# Altium schematic sheet PSU_VCC_CRUVI_ADJ_Buck.SchDoc
size A3; SheetNumber: 12; SheetTotal: 32
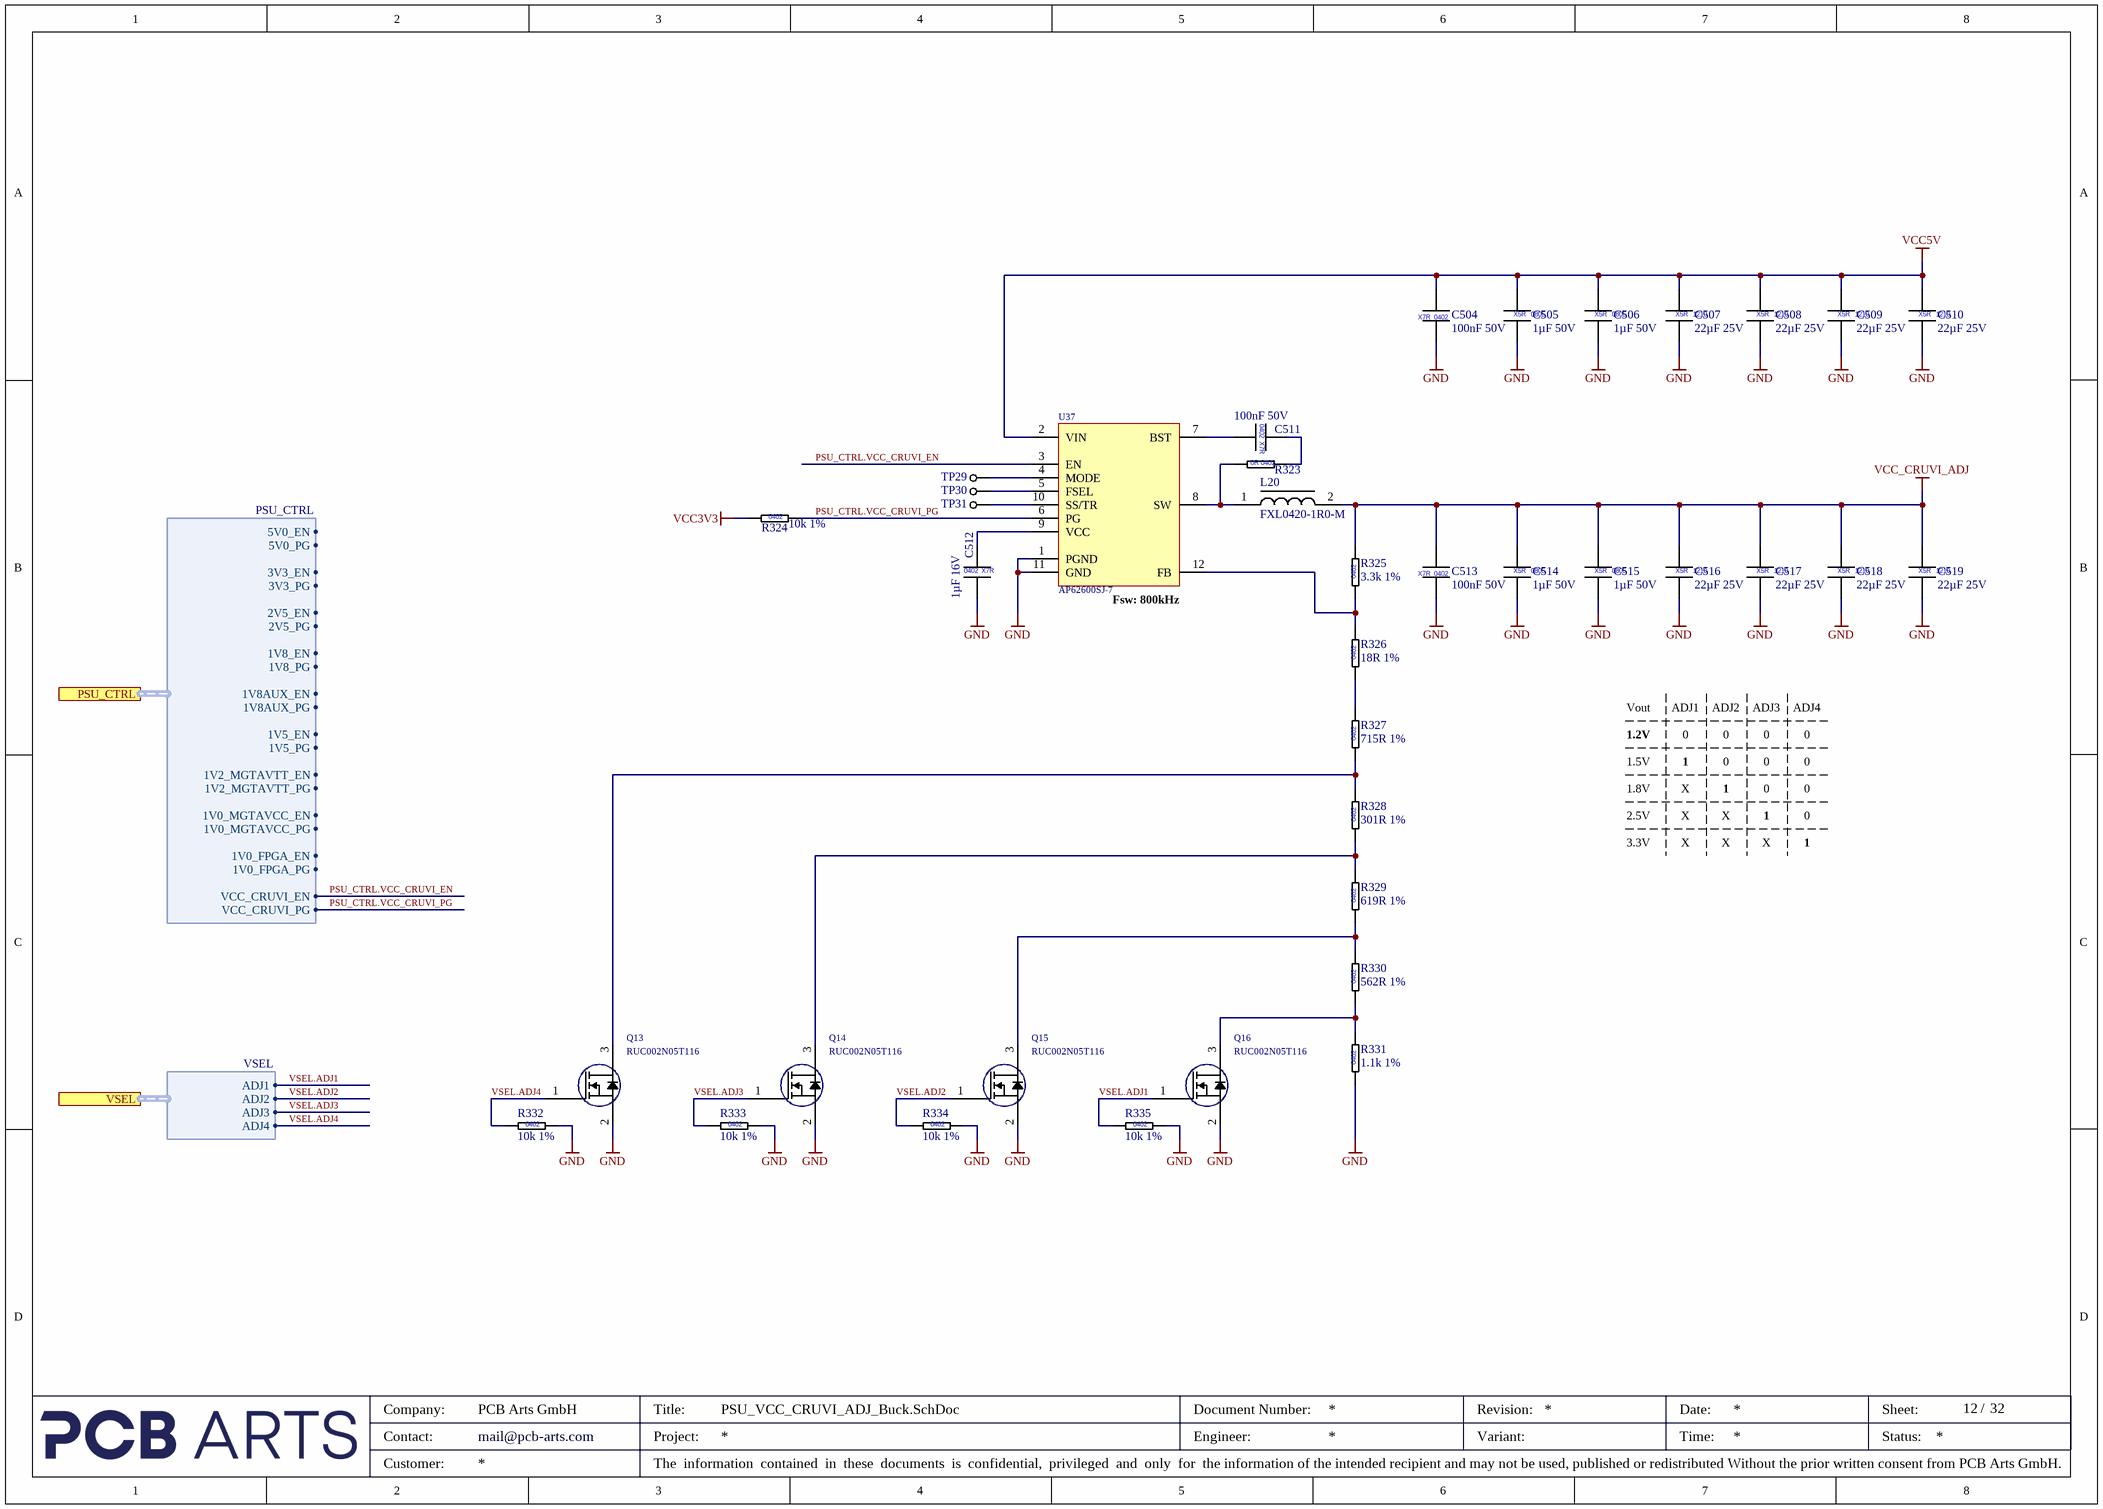
[diagram p0: PSU_VCC_CRUVI_ADJ_Buck.SchDoc]

## Parts
C504  100nF 50V  [CAP_0402_L]
C505  1µF 50V  [CAP_0805]
C506  1µF 50V  [CAP_0805]
C507  22µF 25V  [CAP_1210]
C508  22µF 25V  [CAP_1210]
C509  22µF 25V  [CAP_1210]
C510  22µF 25V  [CAP_1210]
C511  100nF 50V  [CAP_0402_L]
C512  1µF 16V  [CAP_0402_L]
C513  100nF 50V  [CAP_0402_L]
C514  1µF 50V  [CAP_0805]
C515  1µF 50V  [CAP_0805]
C516  22µF 25V  [CAP_1210]
C517  22µF 25V  [CAP_1210]
C518  22µF 25V  [CAP_1210]
C519  22µF 25V  [CAP_1210]
L20  FXL0420-1R0-M  [FXL0420-1R0-M]
Q13  RUC002N05T116  [SOT95P251X112-3N]
Q14  RUC002N05T116  [SOT95P251X112-3N]
Q15  RUC002N05T116  [SOT95P251X112-3N]
Q16  RUC002N05T116  [SOT95P251X112-3N]
R323  0R Jumper  [RES_0402_L]  (value not drawn)
R324  10k 1%  [RES_0402_L]
R325  3.3k 1%  [RES_0402_L]
R326  18R 1%  [RES_0402_L]
R327  715R 1%  [RES_0402_L]
R328  301R 1%  [RES_0402_L]
R329  619R 1%  [RES_0402_L]
R330  562R 1%  [RES_0402_L]
R331  1.1k 1%  [RES_0402_L]
R332  10k 1%  [RES_0402_L]
R333  10k 1%  [RES_0402_L]
R334  10k 1%  [RES_0402_L]
R335  10k 1%  [RES_0402_L]
TP29  Testpoint  [Testpoint 0.8mm]  (value not drawn)  (no BOM)
TP30  Testpoint  [Testpoint 0.8mm]  (value not drawn)  (no BOM)
TP31  Testpoint  [Testpoint 0.8mm]  (value not drawn)  (no BOM)
U37  AP62600SJ-7  [QFN50P200x300x85-12]

## Ports
PSU_CTRL (harness PSU_CTRL, see Power-Tree[2D], PSU_MGTAVCC_Buck[1B], PSU_MGTAVTT_Buck[1B], PSU_VCC1V0_FPGA_Buck[1B], PSU_VCC1V5_Buck[1B], PSU_VCC1V8_Buck[1B], PSU_VCC1V8AUX_Buck[1B], PSU_VCC2V5_Buck[1B], PSU_VCC3V3_Buck[1B], PSU_VCC5V_Buck[1B]), VSEL (harness VSEL, see Power-Tree[2D], Bank 13_Bank 15_Bank 16[8D], Power-Tree[1D])

## Harnesses
PSU_CTRL: 5V0_EN, 5V0_PG, 3V3_EN, 3V3_PG, 2V5_EN, 2V5_PG, 1V8_EN, 1V8_PG, 1V8AUX_EN, 1V8AUX_PG, 1V5_EN, 1V5_PG, 1V2_MGTAVTT_EN, 1V2_MGTAVTT_PG, 1V0_MGTAVCC_EN, 1V0_MGTAVCC_PG, 1V0_FPGA_EN, 1V0_FPGA_PG, VCC_CRUVI_EN, VCC_CRUVI_PG
VSEL: ADJ1, ADJ2, ADJ3, ADJ4

## Nets
GND: C504.1 C505.2 C506.2 C507.2 C508.2 C509.2 C510.2 C512.2 C513.1 C514.2 C515.2 C516.2 C517.2 C518.2 C519.2 Q13.2(D) Q14.2(D) Q15.2(D) Q16.2(D) R331.1 R332.2 R333.2 R334.2 R335.2 U37.1(PGND) U37.11(GND)
VCC3V3: R324.1
VCC5V: C504.2 C505.1 C506.1 C507.1 C508.1 C509.1 C510.1 U37.2(VIN)
VCC_CRUVI_ADJ: C513.2 C514.1 C515.1 C516.1 C517.1 C518.1 C519.1 L20.2 R325.2
PSU_CTRL.VCC_CRUVI_EN: U37.3(EN) ; port PSU_CTRL.VCC_CRUVI_EN
PSU_CTRL.VCC_CRUVI_PG: R324.2 U37.6(PG) ; port PSU_CTRL.VCC_CRUVI_PG
VSEL.ADJ1: Q16.1(G) R335.1 ; port VSEL.ADJ1
VSEL.ADJ2: Q15.1(G) R334.1 ; port VSEL.ADJ2
VSEL.ADJ3: Q14.1(G) R333.1 ; port VSEL.ADJ3
VSEL.ADJ4: Q13.1(G) R332.1 ; port VSEL.ADJ4
NetC511_1: C511.1 R323.2
NetC511_2: C511.2 U37.7(BST)
NetC512_1: C512.1 U37.9(VCC)
NetL20_1: L20.1 R323.1 U37.8(SW)
NetQ13_3: Q13.3(S) R327.1 R328.2
NetQ14_3: Q14.3(S) R328.1 R329.2
NetQ15_3: Q15.3(S) R329.1 R330.2
NetQ16_3: Q16.3(S) R330.1 R331.2
NetR325_1: R325.1 R326.2 U37.12(FB)
NetR326_1: R326.1 R327.2
NetTP29_1: TP29.1(GND) U37.4(MODE)
NetTP30_1: TP30.1(GND) U37.5(FSEL)
NetTP31_1: TP31.1(GND) U37.10(SS/TR)

## Notes on the sheet
- (near U37) Fsw: 800kHz
- Vout
- ADJ1
- ADJ2
- ADJ3
- ADJ4
- 1.2V
- 1.5V
- 1.8V
- 1
- X
- 0
- 2.5V
- 3.3V
- Company:
- Contact:
- Customer:
- mail@pcb-arts.com
- PCB Arts GmbH
- Title:
- Project:
- The  information  contained  in  these  documents  is  confidential,  privileged  and  only  for  the information of the intended recipient and may not be used, published or redistributed Without the prior written consent from PCB Arts GmbH.
- Engineer:
- Document Number:
- Revision:
- Variant:
- Date:
- Time:
- Sheet:
- Status:
- /
- (in symbol CAP_0402_1µF_16V) 0402; X7R
- (in symbol CAP_0402_100nF_50V) 0402; X7R
- (in symbol CAP_0805_1µF_50V) X5R; 0805
- (in symbol CAP_1210_22µF_25V) X5R; 1210
- (in symbol RES_0402_0R Jumper) 0R 0402
- (in symbol RES_0402_1.1k_1%) 0402
- (in symbol RES_0402_3.3k_1%) 0402
- (in symbol RES_0402_10k_1%) 0402
- (in symbol RES_0402_18R_1%) 0402
- (in symbol RES_0402_301R_1%) 0402
- (in symbol RES_0402_562R_1%) 0402
- (in symbol RES_0402_619R_1%) 0402
- (in symbol RES_0402_715R_1%) 0402

## Library data of the parts
C504 C511 C513 = CAP_0402_100nF_50V: Multilayer Ceramic Capacitors MLCC - SMD/SMT 0402 50VDC; Manufacturer 1: Murata Electronics; Manufacturer 1 Prt. Nr.: GCM155L8EH104KE07D; Manufacturer 2 Prt. Nr.: UMK105B7104KV-FR; Manufacturer 2: TDK
C505 C506 C514 C515 = CAP_0805_1µF_50V: Multilayer Ceramic Capacitors MLCC - SMD/SMT 0805 50VDC; Manufacturer 1: Samsung Electro-Mechanics; Manufacturer 1 Prt. Nr.: CL21B105KBFNNNG; Manufacturer 2 Prt. Nr.: UMK212BJ105KGHT; Manufacturer 2: Taiyo Yuden
C507-C510 C516-C519 = CAP_1210_22µF_25V: Multilayer Ceramic Capacitors MLCC - SMD/SMT 1210 25VDC; Manufacturer 1: KEMET; Manufacturer 1 Prt. Nr.: C1210C226K3PACTU; Manufacturer 2 Prt. Nr.: TMK212BBJ226MG-TT; Manufacturer 2: Taiyo Yuden
C512 = CAP_0402_1µF_16V: Multilayer Ceramic Capacitors MLCC - SMD/SMT 0402 16VDC; Manufacturer 1: Taiyo Yuden; Manufacturer 1 Prt. Nr.: EMK105BJ105MVHF; Manufacturer 2 Prt. Nr.: GRM155R61E105KA12D; Manufacturer 2: Murata Electronics
L20 = 1uH 6A 27mΩ  FXL0420-1R0-M: 1uH ±20% 6A 27mΩ SMD,4.4x4.5x1.8mm Power Inductor; Manufacturer 1: cjiang(Changjiang Microelectronics Tech); Manufacturer 1 Prt. Nr.: FXL0420-1R0-M
Q13-Q16 = RUC002N05T116_MOSFET N-Ch 1.2 VGS Spec: MOSFET N-Ch 1.2 VGS Spec; Manufacturer 1: ROHM Semiconductor; Manufacturer 1 Prt. Nr.: RUC002N05T116
R323 = RES_0402_0R Jumper: Thick Film Resistors - SMD 0Ohm; Manufacturer 1: Vishay / Dale; Manufacturer 1 Prt. Nr.: CRCW04020000Z0EDC; Manufacturer 2 Prt. Nr.: RC0402JR-070RL; Manufacturer 2: Yageo
R324 R332-R335 = RES_0402_10k_1%: Thick Film Resistors - SMD 10kOhm 1%; Manufacturer 1: Vishay / Dale; Manufacturer 1 Prt. Nr.: CRCW040210K0FKEDC; Manufacturer 2 Prt. Nr.: RC0402FR-7W10KL; Manufacturer 2: Yageo
R325 = RES_0402_3.3k_1%: Thick Film Resistors - SMD 3.3kOhm 1%; Manufacturer 1: Vishay / Dale; Manufacturer 1 Prt. Nr.: CRCW04023K30FKEDC; Manufacturer 2 Prt. Nr.: RC0402FR-133K3L; Manufacturer 2: Yageo
R326 = RES_0402_18R_1%: Thick Film Resistors - SMD 18Ohm 1%; Manufacturer 1: Vishay / Dale; Manufacturer 1 Prt. Nr.: CRCW040218R0FKEDC; Manufacturer 2 Prt. Nr.: RC0402FR-7W18RL; Manufacturer 2: Yageo
R327 = RES_0402_715R_1%: Thick Film Resistors - SMD 715Ohm 1%; Manufacturer 1: Vishay / Dale; Manufacturer 1 Prt. Nr.: CRCW0402715RFKED; Manufacturer 2 Prt. Nr.: RC0402FR-07715RL; Manufacturer 2: Yageo
R328 = RES_0402_301R_1%: Thick Film Resistors - SMD 301Ohm 1%; Manufacturer 1: Vishay / Dale; Manufacturer 1 Prt. Nr.: CRCW0402301RFKED; Manufacturer 2 Prt. Nr.: RC0402FR-07301RL; Manufacturer 2: Yageo
R329 = RES_0402_619R_1%: Thick Film Resistors - SMD 619Ohm 1%; Manufacturer 1: Vishay / Dale; Manufacturer 1 Prt. Nr.: CRCW0402619RFKED; Manufacturer 2 Prt. Nr.: RC0402FR-07619RL; Manufacturer 2: Yageo
R330 = RES_0402_562R_1%: Thick Film Resistors - SMD 562Ohm 1%; Manufacturer 1: Vishay / Dale; Manufacturer 1 Prt. Nr.: CRCW0402562RFKED; Manufacturer 2 Prt. Nr.: RC0402FR-07562RL; Manufacturer 2: Yageo
R331 = RES_0402_1.1k_1%: Thick Film Resistors - SMD 1.1kOhm 1%; Manufacturer 1: Vishay / Dale; Manufacturer 1 Prt. Nr.: CRCW04021K10FKED; Manufacturer 2 Prt. Nr.: RC0402FR-071K1L; Manufacturer 2: Yageo
TP29-TP31 = Testpoint 0.8mm
U37 = AP62600SJ-7_4.5V TO 18V INPUT, 6A SYNCHRONOUS BUCK CONVERTER: 4.5V TO 18V INPUT, 6A SYNCHRONOUS BUCK CONVERTER; Manufacturer 1: Diodes Incorporated; Manufacturer 1 Prt. Nr.: AP62600SJ-7